# EAGLE schematic sensor_universal (EAGLE 9.2.0)
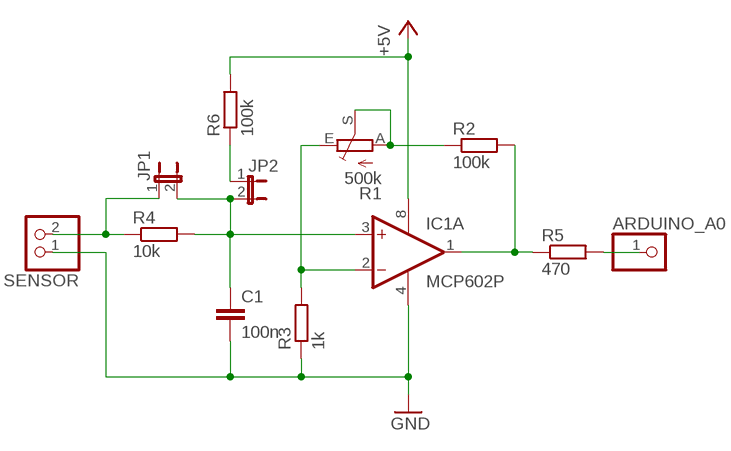
[diagram p0: schematic, sheet 1]

## Parts
ARDUINO_A0  PINHD-1X1  [1X01]
C1  100n  C-EU025-024X044  [C025-024X044]
IC1  MCP602P  [DIL08]
JP1  JP1E  [JP1]
JP2  JP1E  [JP1]
R1  500k  TRIM_EU-B64Y  [B64Y]
R2  100k  R-EU_0204/5  [0204/5]
R3  1k  R-EU_0204/5  [0204/5]
R4  10k  R-EU_0204/5  [0204/5]
R5  470  R-EU_0204/5  [0204/5]
R6  100k  R-EU_0204/5  [0204/5]
SENSOR  PINHD-1X2  [1X02]

## Nets
+5V: IC1.8(P:V+) R6.2
GND: C1.2 IC1.4(P:V-) R3.1 SENSOR.1
N$1: JP1.1 R4.1 SENSOR.2
N$3: IC1.2(A:-IN) R1.E R3.2
N$4: R1.A R1.S R2.1
N$5: IC1.1(A:OUT) R2.2 R5.1
N$6: ARDUINO_A0.1 R5.2
N$8: C1.1 IC1.3(A:+IN) JP1.2 JP2.2 R4.2
N$9: JP2.1 R6.1
Unconnected: IC1.5(B:+IN) IC1.6(B:-IN) IC1.7(B:OUT)

## Library data of the parts
ARDUINO_A0 = pinhead:PINHD-1X1: PIN HEADER
C1 = rcl:C-EU: CAPACITOR, European symbol; SPICEPREFIX: C
IC1 = linear:MCP602: Single Op Amp 2.7V to 6.0V Single Supply CMOS Source: http://ww1.microchip.com/downloads/en/DeviceDoc/21314g.pdf
JP1 JP2 = jumper:JP1E: JUMPER
R1 = pot:TRIM_EU-: POTENTIOMETER
R2-R6 = rcl:R-EU_: RESISTOR, European symbol; SPICEPREFIX: R
SENSOR = pinhead:PINHD-1X2: PIN HEADER